# EAGLE design OSEPP_Uno-Rev1.1 (EAGLE 5.11)
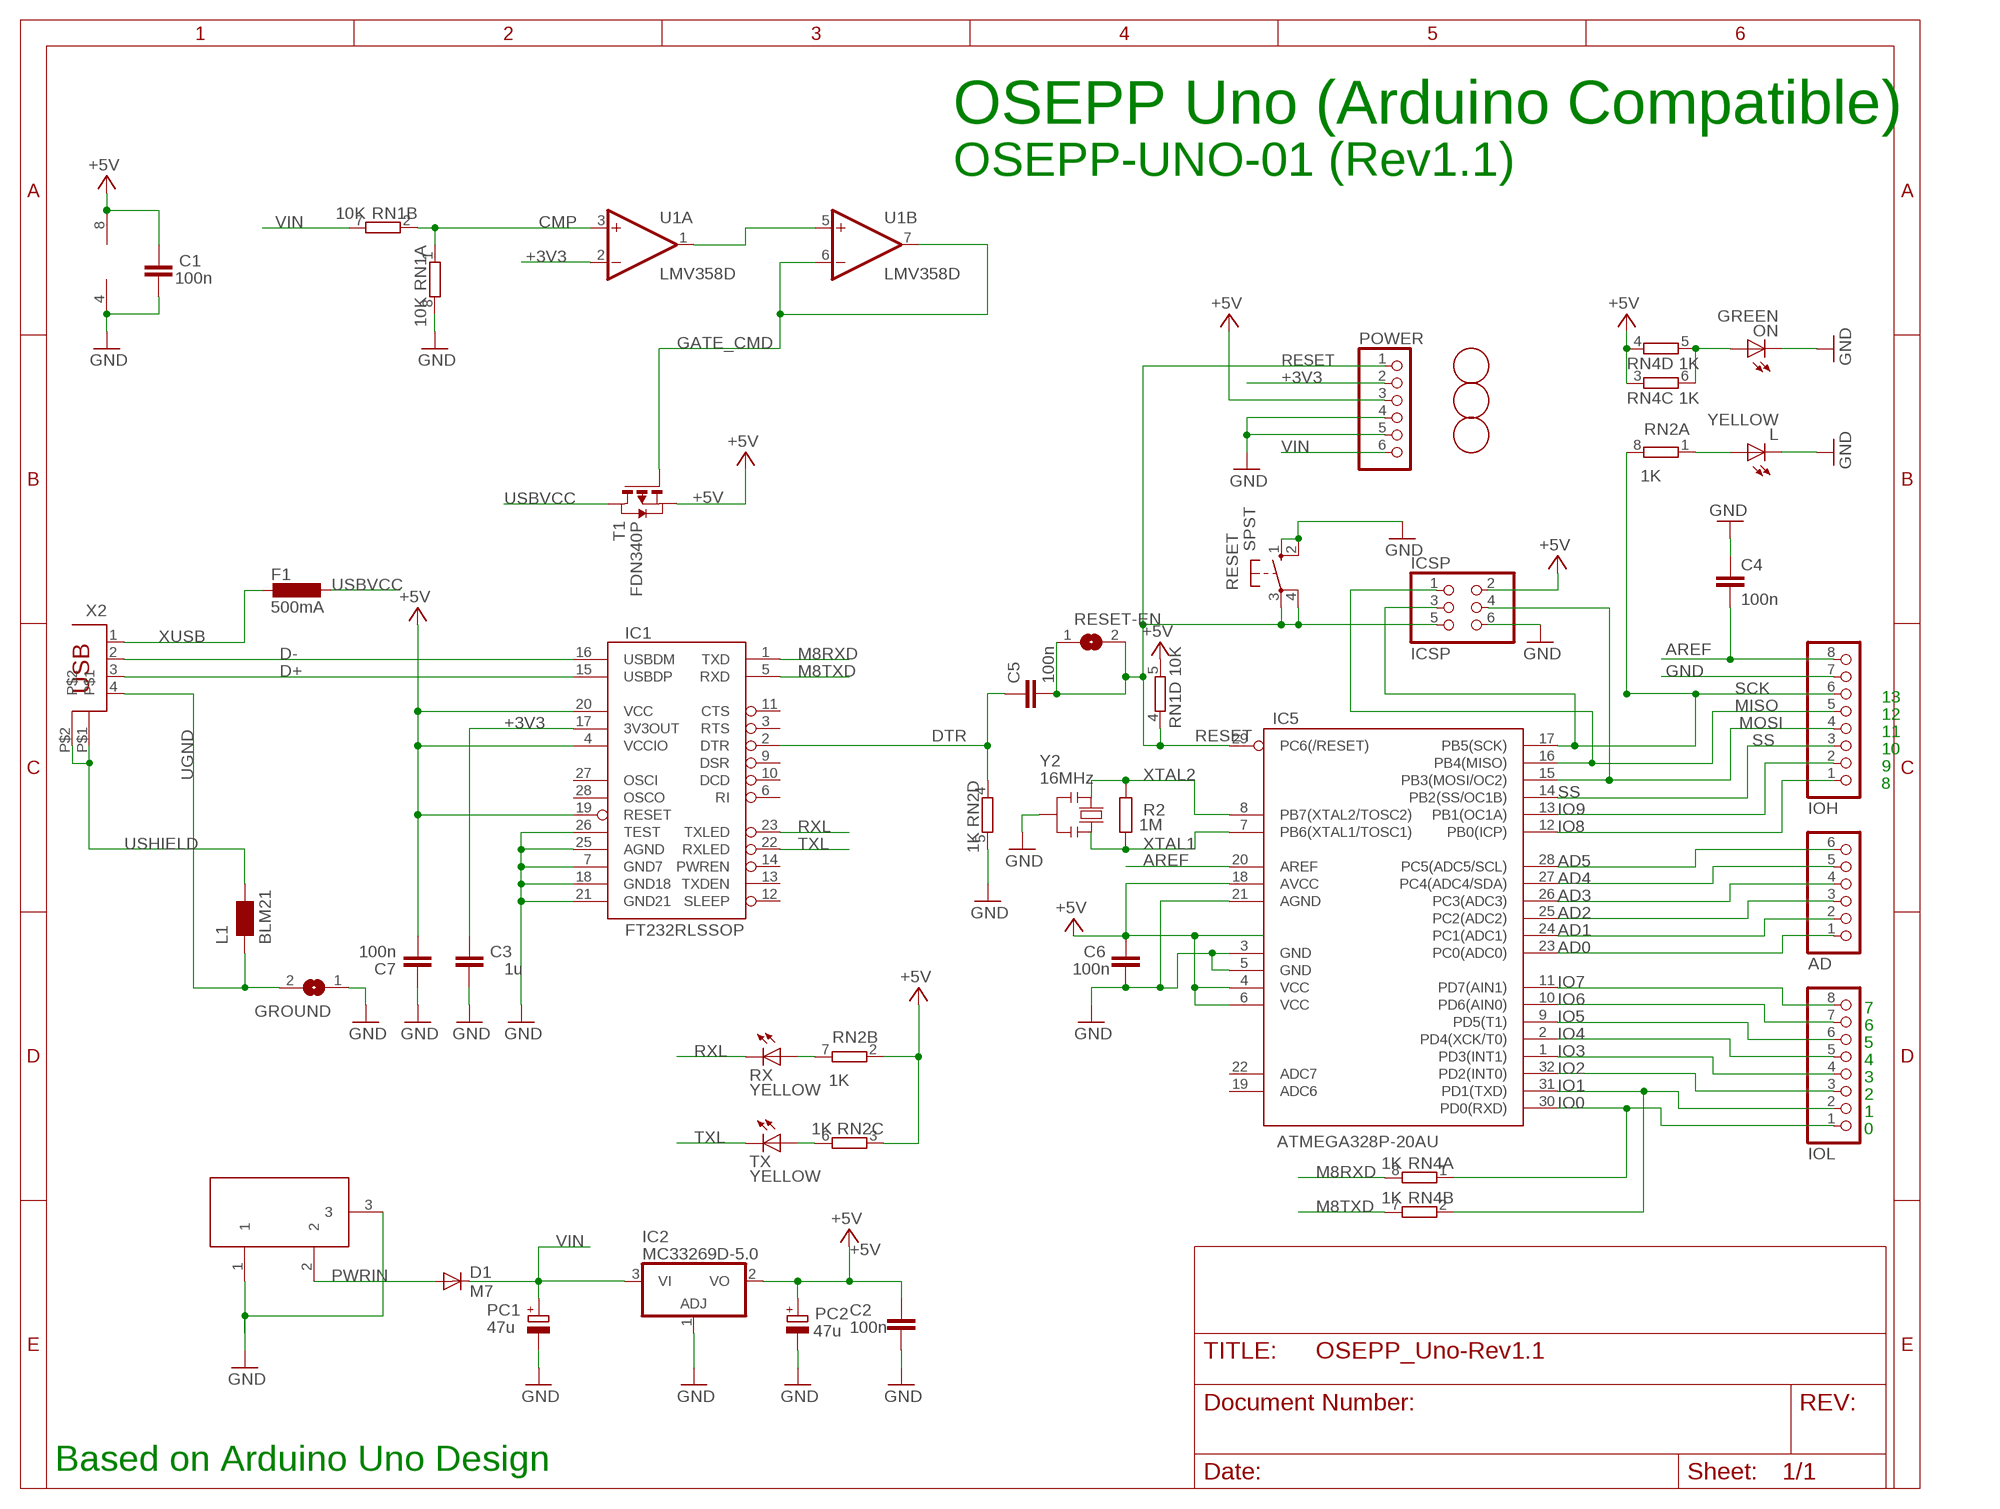
[diagram p0: schematic, sheet 1]

## Parts
AD  PINHD-1X6  [1X06]
C1  100n  C-EU0603-RND  [C0603-ROUND]
C2  100n  C-EU0603-RND  [C0603-ROUND]
C3  1u  C-EU0603-RND  [C0603-ROUND]
C4  100n  C-EU0603-RND  [C0603-ROUND]
C5  100n  C-EU0603-RND  [C0603-ROUND]
C6  100n  C-EU0603-RND  [C0603-ROUND]
C7  100n  C-EU0603-RND  [C0603-ROUND]
D1  M7  DIODE-SMB  [SMB]
F1  500mA  L-EUL1812  [L1812]
GROUND  SJ  [SJ]
IC1  FT232RLSSOP  [SSOP28DB]
IC2  MC33269D-5.0  [DPACK]
IC5  ATMEGA328P-20AU  MEGA8-AI  [TQFP32-08]
ICSP  ICSP  PINHD-2X3  [2X03]
IOH  PINHD-1X8  [1X08]
IOL  PINHD-1X8  [1X08]
L  YELLOW  LEDCHIP-LED0805  [CHIP-LED0805]
L1  BLM21  WE-CBF_0805  [0805]
ON  GREEN  LEDCHIP-LED0805  [CHIP-LED0805]
PC1  47u  CPOL-EUD  [PANASONIC_D]
PC2  47u  CPOL-EUD  [PANASONIC_D]
POWER  PINHD-1X6  [1X06]
R2  1M  R-EU_R0603  [R0603-ROUND]
RESET  SPST  10-XX  [B3F-10XX]
RESET-EN  SJ  [SJ]
RN1  10K  4R-NCAY16  [CAY16]
RN2  1K  4R-NCAY16  [CAY16]
RN4  1K  4R-NCAY16  [CAY16]
RX  YELLOW  LEDCHIP-LED0805  [CHIP-LED0805]
T1  FDN340P  PMOSSOT23  [SOT-23]
TX  YELLOW  LEDCHIP-LED0805  [CHIP-LED0805]
U1  LMV358D  LM358D  [SO08]
U$3  FIDUCIALMOUNT  [FIDUCIA-MOUNT]
U$4  FIDUCIALMOUNT  [FIDUCIA-MOUNT]
U$6  FIDUCIALMOUNT  [FIDUCIA-MOUNT]
X1  DC21MMX  [DC-21MM]
X2  PN61729  [PN61729]
Y2  16MHz  RESONATORMU  [RESONATOR]

## Nets
+3V3: C3.2 IC1.17(3V3OUT) POWER.2 U1.2(A:-IN)
+5V: C1.2 C2.2 C6.2 C7.1 IC1.4(VCCIO) IC1.19(RESET) IC1.20(VCC) IC2.2(VO) IC5.4(VCC) IC5.6(VCC) IC5.18(AVCC) ICSP.2 PC2.+ POWER.3 RN1.5 RN2.2 RN2.3 RN4.3 RN4.4 T1.2(S) U1.8(P:V+)
AD0: AD.1 IC5.23(PC0(ADC0))
AD1: AD.2 IC5.24(PC1(ADC1))
AD2: AD.3 IC5.25(PC2(ADC2))
AD3: AD.4 IC5.26(PC3(ADC3))
AD4: AD.5 IC5.27(PC4(ADC4/SDA))
AD5: AD.6 IC5.28(PC5(ADC5/SCL))
AREF: C4.2 IC5.20(AREF) IOH.8
CMP: RN1.1 RN1.2 U1.3(A:+IN)
D+: IC1.15(USBDP) X2.3
D-: IC1.16(USBDM) X2.2
DTR: C5.1 IC1.2(DTR) RN2.4
GATE_CMD: T1.3(G) U1.6(B:-IN) U1.7(B:OUT)
GND: C1.1 C2.1 C3.1 C4.1 C6.1 C7.2 GROUND.1 IC1.7(GND7) IC1.18(GND18) IC1.21(GND21) IC1.25(AGND) IC1.26(TEST) IC2.1(ADJ) IC5.3(GND) IC5.5(GND) IC5.21(AGND) ICSP.6 IOH.7 L.C ON.C PC1.- PC2.- POWER.4 POWER.5 RESET.1(S) RESET.2(S1) RN1.8 RN2.5 U1.4(P:V-) X1.1 X1.3 Y2.2
IO0: IC5.30(PD0(RXD)) IOL.1 RN4.1
IO1: IC5.31(PD1(TXD)) IOL.2 RN4.2
IO2: IC5.32(PD2(INT0)) IOL.3
IO3: IC5.1(PD3(INT1)) IOL.4
IO4: IC5.2(PD4(XCK/T0)) IOL.5
IO5: IC5.9(PD5(T1)) IOL.6
IO6: IC5.10(PD6(AIN0)) IOL.7
IO7: IC5.11(PD7(AIN1)) IOL.8
IO8: IC5.12(PB0(ICP)) IOH.1
IO9: IC5.13(PB1(OC1A)) IOH.2
M8RXD: IC1.1(TXD) RN4.8
M8TXD: IC1.5(RXD) RN4.7
MISO: IC5.16(PB4(MISO)) ICSP.1 IOH.5
MOSI: IC5.15(PB3(MOSI/OC2)) ICSP.4 IOH.4
N$1: L.A RN2.1
N$2: U1.1(A:OUT) U1.5(B:+IN)
N$3: ON.A RN4.5 RN4.6
N$35: RN2.7 RX.A
N$36: RN2.6 TX.A
PWRIN: D1.A X1.2
RESET: C5.2 IC5.29(PC6(/RESET)) ICSP.5 POWER.1 RESET-EN.1 RESET-EN.2 RESET.3(P) RESET.4(P1) RN1.4
RXL: IC1.23(TXLED) RX.C
SCK: IC5.17(PB5(SCK)) ICSP.3 IOH.6 RN2.8
SS: IC5.14(PB2(SS/OC1B)) IOH.3
TXL: IC1.22(RXLED) TX.C
UGND: GROUND.2 L1.1 X2.4
USBVCC: F1.1 T1.1(D)
USHIELD: L1.2 X2.P$1 X2.P$2
VIN: D1.C IC2.3(VI) PC1.+ POWER.6 RN1.7
XTAL1: IC5.7(PB6(XTAL1/TOSC1)) R2.1 Y2.3
XTAL2: IC5.8(PB7(XTAL2/TOSC2)) R2.2 Y2.1
XUSB: F1.2 X2.1
Unconnected: IC1.3(RTS) IC1.6(RI) IC1.9(DSR) IC1.10(DCD) IC1.11(CTS) IC1.12(SLEEP) IC1.13(TXDEN) IC1.14(PWREN) IC1.27(OSCI) IC1.28(OSCO) IC5.19(ADC6) IC5.22(ADC7) RN1.3 RN1.6

## Notes on the sheet
- OSEPP Uno (Arduino Compatible)
- OSEPP-UNO-01 (Rev1.1)
- 13
- 12
- 11
- 10
- 9
- 8
- 7
- 6
- 5
- 4
- 3
- 2
- 1
- 0
- Based on Arduino Uno Design

## Library data of the parts
AD POWER = pinhead:PINHD-1X6: PIN HEADER
C1-C7 = SmartPrj:C-EU: CAPACITOR, European symbol
D1 = diode:DIODE-: DIODE
F1 = rcl:L-EU: INDUCTOR, European symbol
GROUND RESET-EN = jumper:SJ: SMD solder JUMPER
IC1 = SparkFun:FT232RL: USB UART FT232RL 4th Generation USB UART (USB <-> Serial) Controller. Spark Fun Electronics SKU : COM-00650
IC2 = linear:MC33269?*: Adjustable Output Low Dropout Voltage Regulator 800 mA Source: http://www.onsemi.com/pub/Collateral/MC33269-D.PDF
IC5 = idii:MEGA8: MICROCONTROLLER 8 Kbytes FLASH 1 kbytes SRAM 512 bytes EEPROM USART 6-channel 10 bit ADC 2-channel 8 bit ADC Source: avr.lbr
ICSP = pinhead:PINHD-2X3: PIN HEADER
IOH IOL = pinhead:PINHD-1X8: PIN HEADER
L ON RX TX = led:LED: LED OSRAM: - CHIPLED LG R971, LG N971, LY N971, LG Q971, LY Q971, LO R971, LY R971 LH N974, LH R974 LS Q976, LO Q976, LY Q976 LO Q996 - Hyper CHIPLED LW Q18S LB Q993, LB Q99A, LB R99A - SideLED LS A670, LO A670, LY A670, LG A670, LP A670 LB A673, LV A673, LT A673, LW A673 LH A674 LY A675 LS A676, LA A676, LO A676, LY A676, LW A676 LS A679, LY A679, LG A679 - Hyper Micro SIDELED® LS Y876, LA Y876, LO Y876, LY Y876 LT Y87S - SmartLED LW L88C, LW L88S LB L89C, LB L89S, LG L890 LS L89K, LO L89K, LY L89K LS L896, LA L896, LO L896, LY L896 - TOPLED LS T670, LO T670, LY T670, LG T670, LP T670 LSG T670, LSP T670, LSY T670, LOP T670, LYG T670 LG T671, LOG T671, LSG T671 LB T673, LV T673, LT T673, LW T673 LH T674 LS T676, LA T676, LO T676, LY T676, LB T676, LH T676, LSB T676, LW T676 LB T67C, LV T67C, LT T67C, LS T67K, LO T67K, LY T67K, LW E67C LS E67B, LA E67B, LO E67B, LY E67B, LB E67C, LV E67C, LT E67C LW T67C LS T679, LY T679, LG T679 LS T770, LO T770, LY T770, LG T770, LP T770 LB T773, LV T773, LT T773, LW T773 LH T774 LS E675, LA E675, LY E675, LS T675 LS T776, LA T776, LO T776, LY T776, LB T776 LHGB T686 LT T68C, LB T68C - Hyper Mini TOPLED® LB M676 - Mini TOPLED Santana® LG M470 LS M47K, LO M47K, LY M47K Source: http://www.osram.convergy.de LUXEON: - LUMILED® LXK2-PW12-R00, LXK2-PW12-S00, LXK2-PW14-U00, LXK2-PW14-V00 LXK2-PM12-R00, LXK2-PM12-S00, LXK2-PM14-U00 LXK2-PE12-Q00, LXK2-PE12-R00, LXK2-PE12-S00, LXK2-PE14-T00, LXK2-PE14-U00 LXK2-PB12-K00, LXK2-PB12-L00, LXK2-PB12-M00, LXK2-PB14-N00, LXK2-PB14-P00, LXK2-PB14-Q00 LXK2-PR12-L00, LXK2-PR12-M00, LXK2-PR14-Q00, LXK2-PR14-R00 LXK2-PD12-Q00, LXK2-PD12-R00, LXK2-PD12-S00 LXK2-PH12-R00, LXK2-PH12-S00 LXK2-PL12-P00, LXK2-PL12-Q00, LXK2-PL12-R00 Source: www.luxeon.com KINGBRIGHT: KA-3528ASYC Source: www.kingbright.com
L1 = wuerth-elektronik:WE-CBF: SMD EMI Suppression Ferrite Beads - excellent anti-EMI properties - low DCR - impedances till 3000 ohms - rated current up to 6 A
PC1 PC2 = rcl:CPOL-EU: POLARIZED CAPACITOR, European symbol
R2 = SmartPrj:R-EU_: RESISTOR, European symbol
RESET = switch-omron:10-XX: OMRON SWITCH; MPN: B3F-1000; OC_FARNELL: 176432; OC_NEWARK: 36M3542
RN1 RN2 RN4 = resistor-dil:4R-N: Array Chip Resistor Source: RS Component / Phycomp
T1 = zetex:PMOSSOT23: MOS FET
U1 = linear:LM358: OP AMP also LM158; LM258; LM2904 Source: http://cache.national.com/ds/LM/LM158.pdf
U$3 U$4 U$6 = SmartPrj:FIDUCIALMOUNT
X1 = powersupply:DC21MM
X2 = SmartPrj:PN61729: BERG USB connector
Y2 = SmartPrj:RESONATOR

## Net classes
0 default: width 0.152 mm, drill 0.305 mm, clearance 0.152 mm

## Board
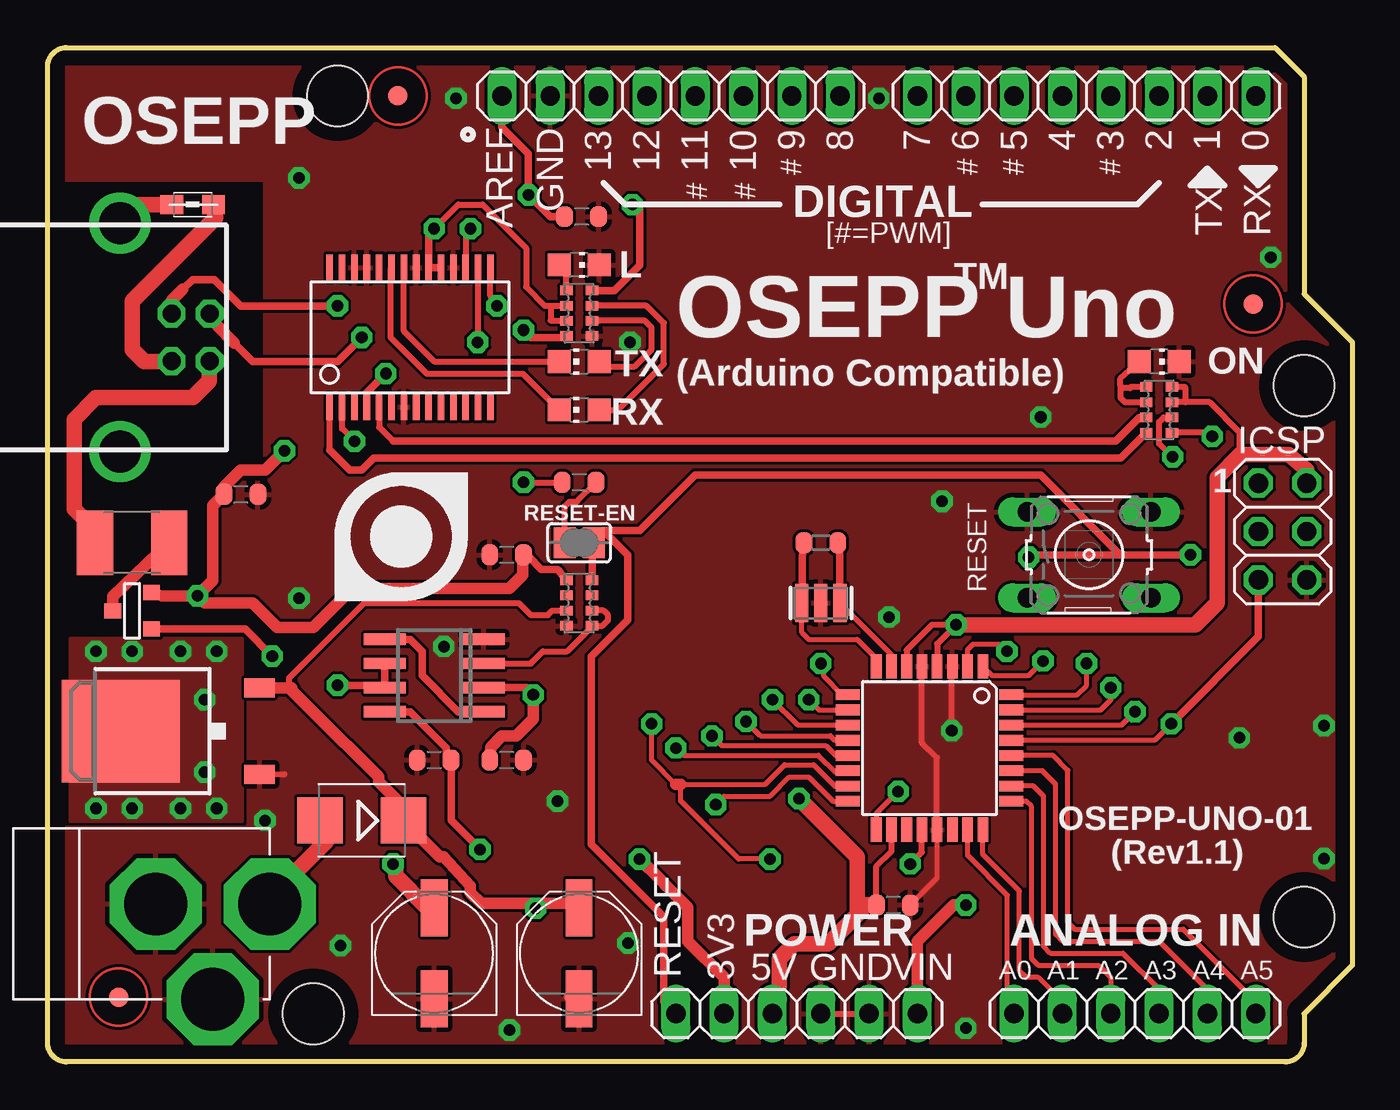
[diagram p1: board, top side]
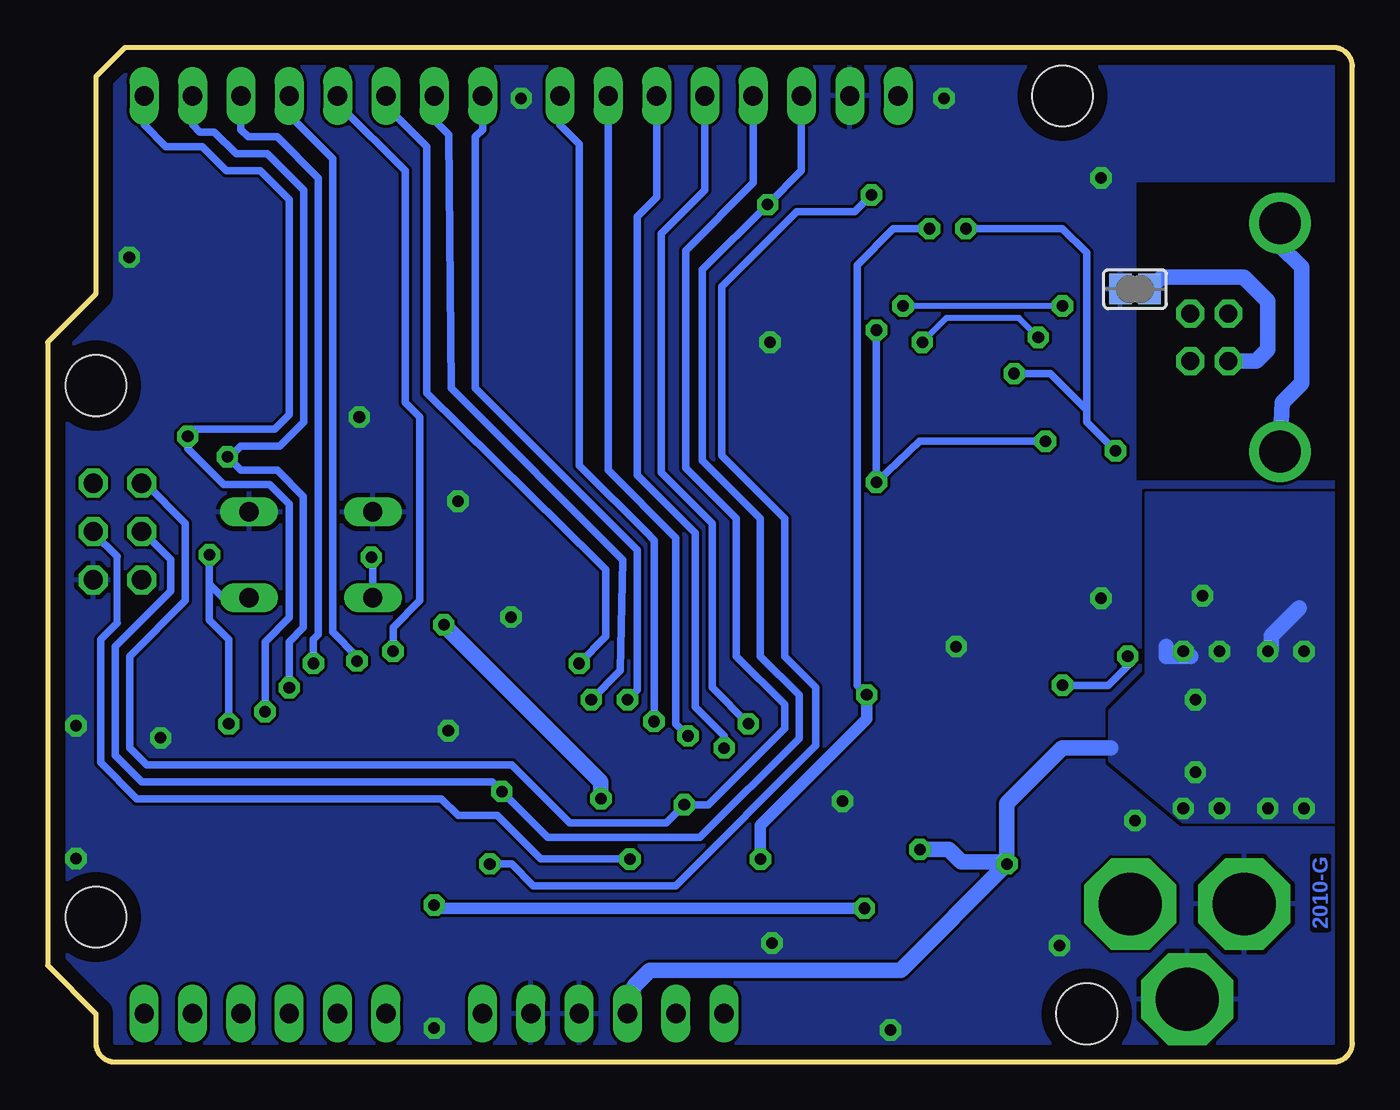
[diagram p2: board, bottom side, seen from below]

Size 68.58 x 53.34 mm. Coordinates in mm from the lower left corner, seen from the top.
Outline: 64.52,53.34 66.04,51.82 66.04,40.39 68.58,37.85 68.58,5.08 66.04,2.54 66.04,1 arc-90 65.04,0 1,0 arc-90 0,1 0,52.34 arc-90 1,53.34 64.52,53.34
Copper layers (1*16): Top 0.035mm / dielectric 1.5mm / Bottom 0.035mm
Design rules "default *": minimum track width 8mil, minimum drill 12mil, track to track 6mil, track to pad 6mil, pad to pad 6mil, via to via 6mil, smd to smd 6mil, copper to edge 30mil, drill to drill 12mil, minimum pad ring 10mil, minimum via ring 10mil, stop-mask expansion 1mil, vias tented up to drill 0mil, thermal gap 10mil
Holes 3.2 mm at 66.04,35.56 66.04,7.62 15.24,50.8 13.97,2.54
vRestrict: area 22.9,44.1 to 24.6,49.1; area 25.4,45.5 to 27.1,49.1; area 28.4,45.3 to 29.6,48.8; area 31,45.3 to 32.1,48.8; area 33.5,45.3 to 34.7,48.8; area 36.1,45.3 to 37.2,48.8; area 38.7,47.2 to 39.9,48.8; area 40.3,45.1 to 47.6,46.9; area 60.3,44.2 to 61.7,46.7; area 62.9,44.2 to 64.3,46.7; area 61.3,35.8 to 64.8,37.2; area 0.6,21.8 to 2,30.1; 14 more areas

### Footprints (pad centres in the part's own frame; a part is rotated, then mirrored left to right if it is on the bottom)
1X06 = drill 1.016 long: 1 -6.35,0; 2 -3.81,0; 3 -1.27,0; 4 1.27,0; 5 3.81,0; 6 6.35,0
C0603-ROUND = smd 0.898 x 1.1: 1 -0.889,0; 2 0.889,0
SMB = smd 2.4 x 2.4: A 2.2,0; C -2.2,0
L1812 = smd 1.9 x 3.4: 1 -1.95,0; 2 1.95,0
SJ = smd 1.168 x 1.6: 1 -0.762,0; 2 0.762,0
SSOP28DB = smd 0.348 x 1.397: 1 -4.225,-3.656; 2 -3.575,-3.656; 3 -2.925,-3.656; 4 -2.275,-3.656; 5 -1.625,-3.656; 6 -0.975,-3.656; 7 -0.325,-3.656; 8 0.325,-3.656; 9 0.975,-3.656; 10 1.625,-3.656; 11 2.275,-3.656; 12 2.925,-3.656; 13 3.575,-3.656; 14 4.225,-3.656; 15 4.225,3.656; 16 3.575,3.656; 17 2.925,3.656; 18 2.275,3.656; 19 1.625,3.656; 20 0.975,3.656; 21 0.325,3.656; 22 -0.325,3.656; 23 -0.975,3.656; 24 -1.625,3.656; 25 -2.275,3.656; 26 -2.925,3.656; 27 -3.575,3.656; 28 -4.225,3.656
DPACK = smd 1 x 1.6: 1 -2.28,-4.8; 3 2.28,-4.8 | smd 5.4 x 6.2: 2 0,2.5
TQFP32-08 = smd 1.27 x 0.559: 1 -4.293,2.8; 2 -4.293,2; 3 -4.293,1.2; 4 -4.293,0.4; 5 -4.293,-0.4; 6 -4.293,-1.2; 7 -4.293,-2; 8 -4.293,-2.8; 17 4.293,-2.8; 18 4.293,-2; 19 4.293,-1.2; 20 4.293,-0.4; 21 4.293,0.4; 22 4.293,1.2; 23 4.293,2; 24 4.293,2.8 | smd 0.559 x 1.27: 9 -2.8,-4.293; 10 -2,-4.293; 11 -1.2,-4.293; 12 -0.4,-4.293; 13 0.4,-4.293; 14 1.2,-4.293; 15 2,-4.293; 16 2.8,-4.293; 25 2.8,4.293; 26 2,4.293; 27 1.2,4.293; 28 0.4,4.293; 29 -0.4,4.293; 30 -1.2,4.293; 31 -2,4.293; 32 -2.8,4.293
2X03 = drill 1.016 octagon: 1 -2.54,-1.27; 2 -2.54,1.27; 3 0,-1.27; 4 0,1.27; 5 2.54,-1.27; 6 2.54,1.27
1X08 = drill 1.016 long: 1 -8.89,0; 2 -6.35,0; 3 -3.81,0; 4 -1.27,0; 5 1.27,0; 6 3.81,0; 7 6.35,0; 8 8.89,0
CHIP-LED0805 = smd 1.2 x 1.2: A 0,-1.05; C 0,1.05
0805 = smd 1.2 x 1: 1 -1.1,0; 2 1.1,0
PANASONIC_D = smd 3 x 1.4: + 2.4,0; - -2.4,0
R0603-ROUND = smd 0.898 x 1.1: 1 -0.889,0; 2 0.889,0
B3F-10XX = drill 1.016 long: 1 -3.251,2.261; 2 3.251,2.261; 3 -3.251,-2.261; 4 3.251,-2.261
CAY16 = smd 0.5 x 0.65: 1 -1.2,-0.675; 2 -0.4,-0.675; 3 0.4,-0.675; 4 1.2,-0.675; 5 1.2,0.675; 6 0.4,0.675; 7 -0.4,0.675; 8 -1.2,0.675
SOT-23 = smd 0.787 x 0.889: 1 0.025,-1.016; 2 -0.94,1.016; 3 0.991,1.016
SO08 = smd 0.6 x 2.2: 1 -1.905,-2.6; 2 -0.635,-2.6; 3 0.635,-2.6; 4 1.905,-2.6; 5 1.905,2.6; 6 0.635,2.6; 7 -0.635,2.6; 8 -1.905,2.6
FIDUCIA-MOUNT = smd 1.016 x 1.016: P$1 0,0
DC-21MM = drill 3.302 pad 4.826 octagon: 1 -5.08,-3.353; 2 -0.076,-6.35; 3 -0.076,-0.356
PN61729 = drill 0.95 octagon: 1 1.25,4.71; 2 -1.25,4.71; 3 -1.25,2.71; 4 1.25,2.71 | drill 2.2 round: P$1 -6,0; P$2 6,0
RESONATOR = smd 0.7 x 2: 1 -1,0; 2 0,0; 3 1,0

### Placement (x,y rotation side)
AD  57.15,2.54 0 top
C1  20.32,15.88 0 top
C2  10.16,29.84 180 top
C3  24.13,15.88 180 top
C4  28.07,44.45 180 top
C5  27.94,30.48 0 top
C6  44.45,8.26 180 top
C7  24.13,26.67 180 top
D1  16.51,12.7 180 top
F1  4.45,27.3 180 top
GROUND  11.43,40.64 0 bottom
IC1  19.05,38.1 0 top
IC2  6.35,17.4 90 top
IC5  46.35,16.51 270 top
ICSP  64.91,27.89 270 top
IOH  32.77,50.8 180 top
IOL  54.61,50.8 180 top
L  27.94,41.91 270 top
L1  7.62,45.09 180 top
ON  58.42,36.83 270 top
PC1  27.94,5.71 90 top
PC2  20.32,5.71 90 top
POWER  39.37,2.54 0 top
R2  40.64,27.3 180 top
RESET  54.74,26.67 0 top
RESET-EN  27.94,27.3 0 top
RN1  27.94,24.13 90 top
RN2  27.94,39.37 270 top
RN4  58.42,34.29 90 top
RX  27.94,34.29 90 top
T1  4.45,23.75 270 top
TX  27.94,36.83 90 top
U1  20.32,20.32 90 top
U$3  18.41,50.8 0 top
U$4  63.37,39.85 0 top
U$6  3.73,3.41 0 top
X1  5.33,8.38 90 top
X2  3.81,38.1 270 top
Y2  40.64,24.13 0 top

### Tracks (layer width: path | path; a pad name or v marks a point on that pad's centre or on a via)
+3V3  (via drill 0.61)
  Top 0.305: IC1.17 21.98,43.56 v22.23,43.81
  Top 0.406: U1.2 25.15,19.68 v25.53,19.3
  Top 0.61: POWER.2 35.56,4.45 33.66,6.35 33.66,8.13 v31.11,10.67 31.62,10.16 | 23.18,15.78 C3.2 23.28,16.55 23.88,17.14 24.64,17.14 25.53,18.03 v25.53,19.3
  Bottom 0.406: v22.23,43.81 24.13,43.81 26.04,41.91 26.04,19.81 v25.53,19.3
  Bottom 0.61: v31.11,10.67 30.99,10.54 31.11,10.54 31.11,12.45 25.53,18.03 v25.53,19.3
+5V  (via drill 0.61)
  Top 0.305: 59.82,34.69 61.07,34.69 62.66,33.1 62.66,31.93 | 59.82,34.69 RN4.3 | RN4.4 59.76,35.49 59.82,35.43 59.82,34.69 | 26.43,39.77 RN2.2 | 26.43,39.77 26.43,39.01 26.47,38.97 RN2.3 | C6.2 43.56,10.29 44.35,11.08 IC5.18 | 26.43,39.77 26.14,39.77 25.15,40.77 25.15,42.8 22.86,45.09 21.59,45.09 v20.32,43.81 | IC5.4 46.76,21.99 v47.75,22.99 46.48,22.99 45.16,21.66 IC5.6
  Top 0.406: U1.8 19.05,18.41 20.95,16.51 20.95,16.09 C1.2 21.21,12.7 v22.73,11.18 | RN1.5 26.87,25.84 26.8,25.91 25.96,25.91 25.3,26.57 | 24.98,26.89 25.3,26.57 | v20.32,43.81 20.02,43.52 IC1.20 IC1.19 | IC1.4 16.77,35.19 v17.78,36.2 | C7.1 25.3,26.67 25.3,26.57 | 66.17,30.44 66.18,30.44 ICSP.2
  Top 0.61: T1.2 6.02,24.51 v7.87,24.51 | v7.87,24.51 8.68,25.31 8.68,29.25 C2.2 9.27,30.23 10.16,31.11 11.43,31.11 v12.45,32.13 | 24.98,26.89 24.98,25.61 24.26,24.89 16,24.89 13.97,22.86 12.06,22.86 10.79,24.13 8.26,24.13 v7.87,24.51
  Top 0.813: POWER.3 38.46,4.01 38.46,5.44 39.24,6.22 41.02,6.22 42.55,7.75 | 66.17,30.44 66.17,31.11 65.23,31.93 62.66,31.93 61.47,30.73 61.47,24.13 60.33,22.99 v47.75,22.99 | PC2.+ 19.95,8.12 18.29,9.78 18.29,10.29 v18.16,10.41 | 42.55,7.75 42.55,10.79 v39.5,13.84 | C6.2 43.05,8.26 42.55,7.75
  Bottom 0.406: v12.45,32.13 13.97,33.66 13.97,34.29 | 13.97,34.29 13.97,42.55 15.24,43.81 v20.32,43.81 | v17.78,36.2 15.88,36.2 13.97,34.29
  Bottom 0.61: 20.56,10.53 20.57,10.54 | v4.45,21.59 4.27,21.67
  Bottom 0.813: POWER.3 37.74,4.01 36.93,4.83 23.75,4.83 v18.16,10.41 | v8.89,21.59 8.51,21.34 9.78,21.34 9.78,21.84 | 4.27,21.67 4.27,22.4 2.79,23.88 | 12.7,16.51 15.24,16.51 18.16,13.59 v18.16,10.41 | 20.57,10.54 21.21,11.18 v22.73,11.18 | 20.56,10.53 18.27,10.53 v18.16,10.41 | v47.75,22.99 39.5,14.73 v39.5,13.84
  other vias: 2.54,21.59 6.99,21.59 2.54,13.34 4.45,13.34 6.99,13.34 8.89,13.34 8.26,15.24 8.26,19.05
  pour Top (no thermals): 1.91,21.59 2.54,22.23 8.26,22.23 10.16,20.32 10.16,14.61 8.26,12.7 2.54,12.7 1.91,13.34
  pour Bottom (no thermals): 0.89,29.84 9.53,29.84 10.79,29.84 10.79,20.32 12.7,18.41 12.7,15.88 8.89,12.7 0.89,12.7
  pour Top (no thermals): 1.91,21.59 2.54,22.23 8.26,22.23 10.16,20.32 10.16,14.61 8.26,12.7 2.54,12.7 1.91,13.34
  pour Top (no thermals): 1.27,12.7 1.27,22.23 10.16,22.23 10.16,12.7
AD0
  Top 0.254: AD.1 50.44,3 50.44,8.76 48.35,10.85 IC5.23
AD1
  Top 0.254: AD.2 53.34,3.17 52.07,4.45 51.44,4.45 51.08,4.8 51.08,8.99 49.16,10.92 IC5.24
AD2
  Top 0.254: AD.3 55.88,4.45 55.24,5.08 52.07,5.08 51.71,5.44 51.71,13.44 51.44,13.71 IC5.25
AD3
  Top 0.254: AD.4 58.42,3.81 56.52,5.71 52.7,5.71 52.35,6.07 52.35,13.97 51.81,14.51 IC5.26
AD4
  Top 0.254: AD.5 60.96,3.81 58.42,6.35 53.34,6.35 52.98,6.71 52.98,14.61 52.28,15.31 IC5.27
AD5
  Top 0.254: AD.6 63.5,3.17 59.69,6.99 53.98,6.99 53.62,7.34 53.62,15.34 52.85,16.11 IC5.28
AREF  (via drill 0.61)
  Top 0.254: IC5.20 46.1,12.45
  Top 0.305: v45.34,10.41 45.95,11.03 IC5.20
  Top 0.406: IOH.8 23.88,49.15 25.27,47.75 v25.27,45.59 26.42,44.45 C4.2
  Bottom 0.406: v25.27,45.59 26.16,44.7 29.21,44.7 33.15,40.77 33.15,31.88 29.84,28.57 29.84,21.34 28.19,19.68 28.19,16.64 35.56,9.27 43.05,9.27 44.2,10.41 v45.34,10.41
CMP
  Top 0.305: U1.3 25.4,20.95 26.04,21.59 27.3,21.59 28.57,22.86 | RN1.2 29.23,23.73 29.46,23.5 29.46,23.24 29.15,22.93 RN1.1
  Top 0.406: 28.57,22.86 28.61,22.86 RN1.1
D+  (via drill 0.61)
  Top 0.305: IC1.15 23.27,40.29 v23.62,39.75
  Top 0.406: 7.11,40.64 7.62,41.15 8.76,41.15 10.16,39.75 v15.24,39.75
  Top 0.61: X2.3 6.52,40.05 7.11,40.64
  Bottom 0.305: v15.24,39.75 v23.62,39.75
D-  (via drill 0.61)
  Top 0.305: IC1.16 22.62,38.5 v22.61,37.85
  Top 0.406: 9.82,37.81 10.79,36.83 15.24,36.83 v16.51,38.1
  Top 0.61: X2.2 8.91,38.72 9.82,37.81
  Bottom 0.305: v16.51,38.1 17.53,39.12 21.34,39.12 v22.61,37.85
DTR  (via drill 0.61)
  Top 0.305: v25.02,30.48 C5.1 | 27.2,38.1 RN2.4 | v16.13,32.64 15.47,33.29 IC1.2
  Top 0.406: 27.2,38.1 25.4,38.1 v25.02,38.48
  Bottom 0.406: v25.02,30.48 25.27,30.48 | v25.02,30.48 v25.02,38.48 | v25.02,30.48 22.73,32.64 v16.13,32.64
GATE_CMD  (via drill 0.61)
  Top 0.406: v11.81,21.34 10.39,22.76 T1.3 | U1.6 U1.7 17.78,19.68 17.65,19.81 v15.24,19.81
  Bottom 0.406: v11.81,21.34 11.81,20.83 12.83,19.81 v15.24,19.81
GND  (via drill 0.61)
  Top 0.254: C6.1 46.76,9.67 IC5.21
  Top 0.305: POWER.4 POWER.5 | IC2.1 12.45,15.14 | 19.86,3.3 PC2.- | IC5.3 47.52,20.8 v47.52,17.42 | IC5.5 45.95,16.78 46.74,16 46.74,12.24 IC5.21
  Top 0.406: 27.3,3.43 PC1.-
  Bottom 0.305: GROUND.1 10.79,40.64
  other vias: 30.51,6.25 26.8,13.72 15.39,6.12 52.2,33.91 30.61,37.85 11.43,12.7 43.69,50.67 48.26,1.78 24.28,1.68 67.08,10.69 64.29,42.32 13.21,24.38 67.08,17.68 20.83,21.84 13.21,46.48 21.46,50.67 47.02,29.49 62.64,17.04 44.22,23.39
  pour Bottom (rank 2): 0.64,52.7 67.69,52.7 67.94,52.45 67.94,0.64 0.89,0.64 0.64,0.89 0.64,30.48 11.43,30.48 11.43,46.35 0.64,46.35
  pour Top (rank 2): 0.64,52.7 67.94,52.7 67.94,0.64 0.64,0.64 0.64,30.48 11.43,30.48 11.43,46.35 0.64,46.35
IO0  (via drill 0.61)
  Top 0.254: v57.15,18.41 56.45,17.71 IC5.30
  Top 0.305: RN4.1 61.02,33.09 v61.21,32.89
  Bottom 0.406: IOL.1 63.5,49.28 62.36,48.13 60.45,48.13 59.18,46.86 57.4,46.86 55.88,45.34 55.88,34.04 56.64,33.27 60.83,33.27 v61.21,32.89 61.21,32.26 59.31,30.35 56.9,30.35 55.88,29.34 55.88,23.37 57.15,22.1 v57.15,18.41
IO1  (via drill 0.61)
  Top 0.254: v55.88,19.68 55.88,19.05 55.34,18.51 IC5.31
  Top 0.305: RN4.2 58.66,33.89 58.42,33.66 58.42,32.51 v59.13,31.83
  Top 0.406: v59.13,31.83 59.09,31.86
  Bottom 0.406: 60.96,50.55 IOL.2 60.96,49.28 60.58,48.9 59.82,48.9 58.67,47.75 57.02,47.75 55.12,45.85 55.12,33.66 56.39,32.38 58.42,32.38 58.85,31.95 59,31.95 v59.13,31.83 58.42,31.11 56.52,31.11 55.14,29.74 55.14,22.84 55.88,22.1 v55.88,19.68
IO2  (via drill 0.61)
  Top 0.254: v54.61,20.95 54.61,19.81 54.1,19.3 IC5.32
  Bottom 0.406: 58.42,50.42 IOL.3 58.42,49.02 58.04,48.64 56.52,48.64 54.36,46.48 54.36,22.48 54.61,22.23 v54.61,20.95
IO3  (via drill 0.61)
  Top 0.254: v52.32,21.08 51.56,20.32 49.64,20.32 IC5.1
  Bottom 0.406: IOL.4 55.88,49.78 53.59,47.5 53.59,22.61 52.32,21.34 v52.32,21.08
IO4  (via drill 0.61)
  Top 0.254: IC5.2 48.35,21.68 48.64,21.97 50.04,21.97 v50.42,21.59
  Bottom 0.406: IOL.5 53.21,50.29 49.78,46.86 49.78,34.67 49.02,33.91 49.02,24.26 50.42,22.86 v50.42,21.59
IO5  (via drill 0.61)
  Top 0.254: v40.64,20.95 40.8,20.8 40.8,20.29 41.78,19.31 IC5.9
  Bottom 0.406: 39.69,26.35 39.37,26.04 | 39.69,26.35 48.64,35.18 48.64,48.13 50.8,50.29 IOL.6 | 39.69,26.35 39.23,25.9 39.23,22.36 v40.64,20.95
IO6  (via drill 0.61)
  Top 0.254: v40.01,19.05 40.55,18.51 IC5.10
  Bottom 0.406: IOL.7 48.26,49.53 47.5,48.77 47.37,35.43 38.34,26.41 38.47,20.58 v40.01,19.05
IO7  (via drill 0.61)
  Top 0.254: v38.1,19.05 39.44,17.71 IC5.11
  Bottom 0.406: IOL.8 45.72,49.02 46.1,48.64 46.1,35.43 37.58,26.91 37.58,19.57 v38.1,19.05
IO8  (via drill 0.61)
  Top 0.254: IC5.12 41.38,16.91 41.15,17.14 37.47,17.14 v36.7,17.91
  Bottom 0.406: IOH.1 41.66,49.28 40.64,48.26 40.64,31.37 37.02,27.75 36.83,27.56 36.7,27.43 v36.7,17.91
IO9  (via drill 0.61)
  Top 0.254: v34.92,17.14 35.43,16.64 40.89,16.64 41.42,16.11 IC5.13
  Bottom 0.406: IOH.2 39.12,31.11 35.56,27.56 35.56,17.78 v34.92,17.14
M8RXD
  Top 0.305: 14.82,32.16 IC1.1
  Top 0.406: RN4.8 56.41,31.75 17.14,31.75 16.51,31.11 15.88,31.11 14.82,32.16
M8TXD
  Top 0.305: 18.16,32.64 17.43,33.38 IC1.5
  Top 0.406: RN4.7 57.38,33.89 56.13,32.64 18.16,32.64
MISO  (via drill 0.61)
  Top 0.254: v35.12,13.53 35.56,13.97 37.97,13.97 38.99,14.99 40.01,14.99 41.28,13.71 IC5.16
  Bottom 0.406: IOH.5 31.5,46.23 35.05,42.67 35.05,31.24 32.38,28.57 32.38,21.34 29.84,18.8 29.84,17.53 33.85,13.53 v35.12,13.53 36.07,12.57 41.15,12.57 44.2,15.62 63.37,15.62 64.26,16.51 64.26,21.34 61.34,24.26 61.34,28.32 63.45,30.43 ICSP.1
MOSI  (via drill 0.61)
  Top 0.254: v31.75,17.78 31.75,15.88 33.02,14.61 | v37.97,10.67 36.32,10.67 33.27,13.72 33.27,14.61 37.72,14.61 38.73,15.62 40.26,15.62 41.37,14.51 IC5.15
  Top 0.61: 33.27,14.61 33.02,14.61
  Bottom 0.381: 64.92,23.09 64.92,26.57
  Bottom 0.406: IOH.4 34.04,45.85 36.32,43.56 36.32,30.99 33.66,28.32 33.66,19.68 v31.75,17.78 | ICSP.4 66.18,27.83 64.92,26.57 | 64.92,23.09 65.79,22.23 65.79,15.75 63.88,13.84 47.88,13.84 46.99,12.95 44.96,12.95 42.67,10.67 v37.97,10.67
N$1
  Top 0.305: RN2.1 27.27,41.53 L.A
N$2
  Top 0.406: U1.5 19.05,22.23 19.68,21.59 19.68,20.32 21.59,18.41 U1.1 23.5,18.41
N$3
  Top 0.305: RN4.6 56.62,34.69 56.39,34.92 56.39,35.56 | 56.39,35.56 56.39,35.94 ON.A | RN4.5 56.95,35.49 56.9,35.43 56.52,35.43 56.39,35.56
N$35
  Top 0.305: RX.A 29.97,34.29 32.38,36.7 32.38,38.86 31.48,39.77 RN2.7
N$36
  Top 0.305: TX.A 29.25,36.57 30.86,36.57 31.75,37.47 31.75,38.61 31.39,38.97 RN2.6 28.98,38.97
PWRIN
  Top 0.61: 14.68,11.63 D1.A
  Top 0.813: 14.68,11.63 13.21,10.16 X1.2
RESET  (via drill 0.61)
  Top 0.254: v59.05,17.78 58.19,16.91 IC5.29
  Top 0.305: RESET-EN.1 27.18,29.21 27.43,29.46 27.81,29.46 C5.2 | 29.84,27.94 29.86,27.92
  Top 0.406: RESET-EN.2 RESET-EN.1 | ICSP.5 63.64,22.36 v59.05,17.78 | 29.21,27.94 RESET-EN.2 | 29.21,27.94 29.84,27.94 31.11,27.94 34.04,30.86 52.2,30.86 56.39,26.67 | POWER.1 32.38,3.17 32.38,7.62 28.57,11.43 28.57,21.34 30.48,23.24 30.48,26.67 29.21,27.94 | RN1.4 28.61,27.85 RESET-EN.2 | v60.07,26.67 56.52,26.67 56.39,26.67 | 56.39,26.67 51.69,26.67 v51.56,26.54
  Bottom 0.406: v59.05,17.78 59.05,22.23 60.07,23.24 60.07,25.15 | RESET.4 59.33,24.41 60.07,25.15 | RESET.3 51.49,26.62 v51.56,26.54 | v60.07,26.67 60.07,25.15
RXL
  Top 0.305: RX.C 24.98,36.2 19.94,36.2 18.03,38.1 18.03,41.72 IC1.23
SCK  (via drill 0.61)
  Top 0.254: v44.7,14.22 43.55,13.07 IC5.17
  Top 0.406: RN2.8 29.77,40.57 31.11,41.91 31.11,44.83 v30.73,45.09
  Bottom 0.406: ICSP.3 63.58,27.89 62.1,26.42 62.1,24.77 65.02,21.84 65.02,16.13 63.63,14.73 45.21,14.73 v44.7,14.22 42.29,11.81 34.29,11.81 29.08,17.02 29.08,19.3 31.11,21.34 31.11,28.57 34.16,31.62 34.16,41.66 v30.73,45.09 28.96,46.86 IOH.6
SS  (via drill 0.61)
  Top 0.254: IC5.14 42.48,15.31 42.55,15.24 41.4,15.24 40.51,16.13 33.4,16.13 v33.02,16.51
  Bottom 0.406: IOH.3 36.58,45.47 37.59,44.45 37.59,30.86 34.54,27.81 34.54,18.67 33.02,17.14 v33.02,16.51
TXL
  Top 0.305: TX.C 20.32,36.83 18.73,38.42 IC1.22
UGND
  Top 0.813: L1.1 8.85,44.41 4.45,40.01 4.45,37.47 5.08,36.83 6.5,36.83 X2.4
  Bottom 0.813: X2.4 5.06,36.85 4.45,37.47 4.45,40.01 5.71,41.27 10.03,41.27 GROUND.2
USBVCC
  Top 0.61: 6.35,27.35 F1.1 3.43,24.47 T1.1
USHIELD
  Top 0.813: L1.2 4.79,45.09 X2.P$1
  Bottom 0.813: X2.P$2 3.68,34.67 2.67,35.69 2.67,41.78 3.81,42.93 X2.P$1
VIN  (via drill 0.61)
  Top 0.305: 12.7,19.68 12.7,20.18 16.65,24.13 24.77,24.13 25.4,23.5 26.29,23.5 26.52,23.73 RN1.7
  Top 0.61: PC1.+ 27.25,8.33 25.91,8.33 v25.65,8.08 25.4,8.33 22.78,8.33 22.23,8.89 22.23,9.27 20.83,10.79 20.61,10.79 D1.C 19.05,12.7 18.41,13.34 18.41,13.72 17.4,14.73 17.4,14.99 13.97,18.41 12.7,19.68 | v48.26,8.26 47.62,8.26 45.72,6.35 POWER.6 | 11.75,19.71 IC2.3 12.7,19.68 | 12.7,19.68 12.84,19.68 12.7,19.68
  Bottom 0.61: v25.65,8.08 48.08,8.08 v48.26,8.26
XTAL1
  Top 0.254: Y2.3 44.35,21.41 IC5.7
  Top 0.406: Y2.3 41.64,26.65 R2.1
XTAL2
  Top 0.254: Y2.1 39.64,22.59 40.01,22.23 42.55,22.23 43.55,21.21 IC5.8
  Top 0.406: Y2.1 39.66,24.15 39.66,26.54 R2.2
XUSB
  Top 0.813: F1.2 2.5,27.98 1.4,29.08 1.4,33.78 2.54,34.92 7.62,34.92 8.51,35.81 X2.1

### Text on the board
Bottom: 2010-G
tNames: AREF | GND | 13 | 12 | 11 | 10 | 9 | 8 | 7 | 6 | 5 | 4 | 3 | 2 | 1 | 0 | OSEPP | # | # | # | # | # | # | DIGITAL | [#=PWM] | TX | RX | TM | OSEPP Uno | TX | (Arduino Compatible) | RX | 1 | OSEPP-UNO-01 | (Rev1.1) | ANALOG IN | RESET | 3V3 | 5V | GND | VIN | A0 | A1 | A2 | A3 | A4 | A5
ReferenceLC: L | TX | ON | RX | ICSP | RESET | o | PC1 | PC2 | POWER | Note on LEDs: label denotes cathode side | Note on U1: o marks pin1
214bmp: D:/SmartProjects/Snc/a4_bn_logo2.bmp